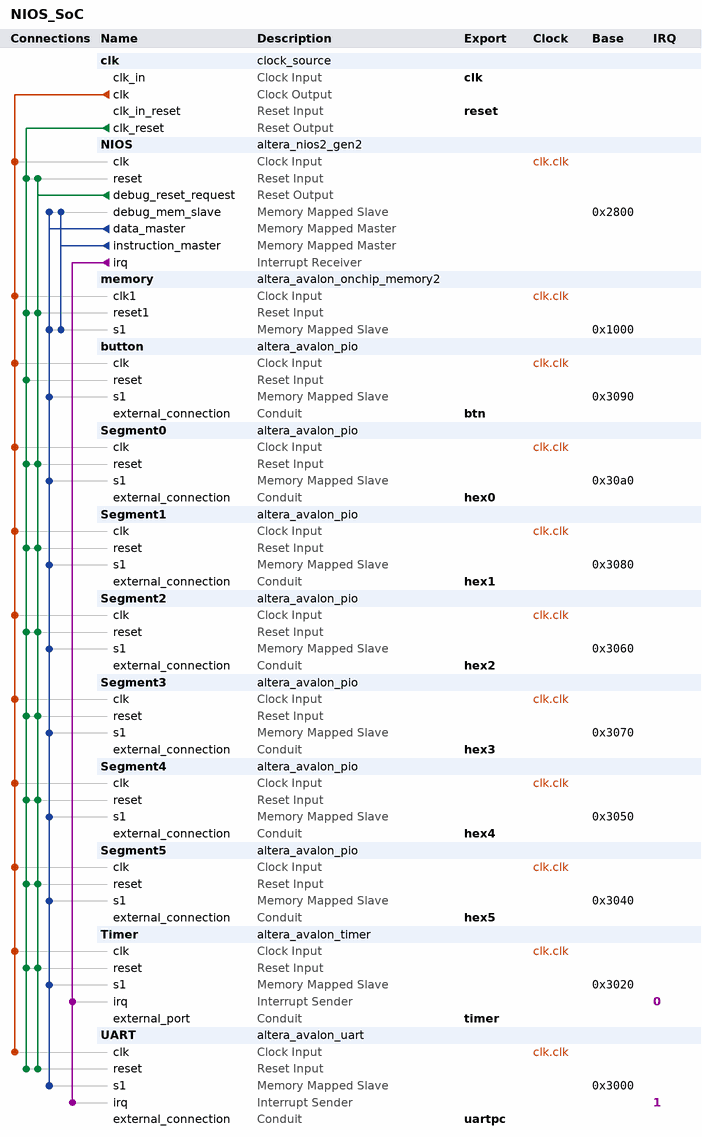
[diagram p0: system contents]
# Platform Designer (Qsys) system NIOS_SoC, Cyclone V 5CSEMA5F31C6
# Parameters at their usual value, and those the tool derives, are not listed.
package require -exact qsys 18.1
create_system NIOS_SoC
set_project_property DEVICE_FAMILY {Cyclone V}
set_project_property DEVICE 5CSEMA5F31C6

add_instance clk clock_source 18.1
set_instance_parameter_value clk clockFrequency 50000000

add_instance NIOS altera_nios2_gen2 18.1
set_instance_parameter_value NIOS dcache_size 2048
set_instance_parameter_value NIOS exceptionSlave memory.s1
set_instance_parameter_value NIOS icache_size 4096
set_instance_parameter_value NIOS impl Tiny
set_instance_parameter_value NIOS resetSlave memory.s1

add_instance memory altera_avalon_onchip_memory2 18.1
set_instance_parameter_value memory dataWidth 32
set_instance_parameter_value memory dualPort false
set_instance_parameter_value memory initMemContent true
set_instance_parameter_value memory initializationFileName onchip_mem.hex
set_instance_parameter_value memory memorySize 4096

add_instance button altera_avalon_pio 18.1
set_instance_parameter_value button direction Input
set_instance_parameter_value button width 4

add_instance Segment0 altera_avalon_pio 18.1
set_instance_parameter_value Segment0 direction Output
set_instance_parameter_value Segment0 width 7

add_instance Segment1 altera_avalon_pio 18.1
set_instance_parameter_value Segment1 direction Output
set_instance_parameter_value Segment1 width 7

add_instance Segment2 altera_avalon_pio 18.1
set_instance_parameter_value Segment2 direction Output
set_instance_parameter_value Segment2 width 7

add_instance Segment3 altera_avalon_pio 18.1
set_instance_parameter_value Segment3 direction Output
set_instance_parameter_value Segment3 width 7

add_instance Segment4 altera_avalon_pio 18.1
set_instance_parameter_value Segment4 direction Output
set_instance_parameter_value Segment4 width 7

add_instance Segment5 altera_avalon_pio 18.1
set_instance_parameter_value Segment5 direction Output
set_instance_parameter_value Segment5 width 7

add_instance Timer altera_avalon_timer 18.1
set_instance_parameter_value Timer alwaysRun true
set_instance_parameter_value Timer period 1
set_instance_parameter_value Timer periodUnits SEC
set_instance_parameter_value Timer timeoutPulseOutput true

add_instance UART altera_avalon_uart 18.1
set_instance_parameter_value UART baud 115200
set_instance_parameter_value UART dataBits 8
set_instance_parameter_value UART fixedBaud true
set_instance_parameter_value UART parity NONE
set_instance_parameter_value UART stopBits 1

# connections
add_connection clk.clk button.clk clock
add_connection clk.clk memory.clk1 clock
add_connection clk.clk NIOS.clk clock
add_connection clk.clk Segment0.clk clock
add_connection clk.clk Segment1.clk clock
add_connection clk.clk Segment2.clk clock
add_connection clk.clk Segment3.clk clock
add_connection clk.clk Segment4.clk clock
add_connection clk.clk Segment5.clk clock
add_connection clk.clk Timer.clk clock
add_connection clk.clk UART.clk clock
add_connection clk.clk_reset button.reset reset
add_connection clk.clk_reset memory.reset1 reset
add_connection clk.clk_reset NIOS.reset reset
add_connection clk.clk_reset Segment0.reset reset
add_connection clk.clk_reset Segment1.reset reset
add_connection clk.clk_reset Segment2.reset reset
add_connection clk.clk_reset Segment3.reset reset
add_connection clk.clk_reset Segment4.reset reset
add_connection clk.clk_reset Segment5.reset reset
add_connection clk.clk_reset Timer.reset reset
add_connection clk.clk_reset UART.reset reset
add_connection NIOS.debug_reset_request memory.reset1 reset
add_connection NIOS.debug_reset_request NIOS.reset reset
add_connection NIOS.debug_reset_request Segment0.reset reset
add_connection NIOS.debug_reset_request Segment1.reset reset
add_connection NIOS.debug_reset_request Segment2.reset reset
add_connection NIOS.debug_reset_request Segment3.reset reset
add_connection NIOS.debug_reset_request Segment4.reset reset
add_connection NIOS.debug_reset_request Segment5.reset reset
add_connection NIOS.debug_reset_request Timer.reset reset
add_connection NIOS.debug_reset_request UART.reset reset
add_connection NIOS.data_master button.s1 avalon
set_connection_parameter_value NIOS.data_master/button.s1 baseAddress 0x3090
add_connection NIOS.data_master memory.s1 avalon
set_connection_parameter_value NIOS.data_master/memory.s1 baseAddress 0x1000
add_connection NIOS.data_master NIOS.debug_mem_slave avalon
set_connection_parameter_value NIOS.data_master/NIOS.debug_mem_slave baseAddress 0x2800
add_connection NIOS.data_master Segment0.s1 avalon
set_connection_parameter_value NIOS.data_master/Segment0.s1 baseAddress 0x30a0
add_connection NIOS.data_master Segment1.s1 avalon
set_connection_parameter_value NIOS.data_master/Segment1.s1 baseAddress 0x3080
add_connection NIOS.data_master Segment2.s1 avalon
set_connection_parameter_value NIOS.data_master/Segment2.s1 baseAddress 0x3060
add_connection NIOS.data_master Segment3.s1 avalon
set_connection_parameter_value NIOS.data_master/Segment3.s1 baseAddress 0x3070
add_connection NIOS.data_master Segment4.s1 avalon
set_connection_parameter_value NIOS.data_master/Segment4.s1 baseAddress 0x3050
add_connection NIOS.data_master Segment5.s1 avalon
set_connection_parameter_value NIOS.data_master/Segment5.s1 baseAddress 0x3040
add_connection NIOS.data_master Timer.s1 avalon
set_connection_parameter_value NIOS.data_master/Timer.s1 baseAddress 0x3020
add_connection NIOS.data_master UART.s1 avalon
set_connection_parameter_value NIOS.data_master/UART.s1 baseAddress 0x3000
add_connection NIOS.instruction_master memory.s1 avalon
set_connection_parameter_value NIOS.instruction_master/memory.s1 baseAddress 0x1000
add_connection NIOS.instruction_master NIOS.debug_mem_slave avalon
set_connection_parameter_value NIOS.instruction_master/NIOS.debug_mem_slave baseAddress 0x2800
add_connection NIOS.irq Timer.irq interrupt
set_connection_parameter_value NIOS.irq/Timer.irq irqNumber 0
add_connection NIOS.irq UART.irq interrupt
set_connection_parameter_value NIOS.irq/UART.irq irqNumber 1

# exported interfaces
add_interface btn conduit end
set_interface_property btn EXPORT_OF button.external_connection
add_interface clk clock sink
set_interface_property clk EXPORT_OF clk.clk_in
add_interface hex0 conduit end
set_interface_property hex0 EXPORT_OF Segment0.external_connection
add_interface hex1 conduit end
set_interface_property hex1 EXPORT_OF Segment1.external_connection
add_interface hex2 conduit end
set_interface_property hex2 EXPORT_OF Segment2.external_connection
add_interface hex3 conduit end
set_interface_property hex3 EXPORT_OF Segment3.external_connection
add_interface hex4 conduit end
set_interface_property hex4 EXPORT_OF Segment4.external_connection
add_interface hex5 conduit end
set_interface_property hex5 EXPORT_OF Segment5.external_connection
add_interface reset reset sink
set_interface_property reset EXPORT_OF clk.clk_in_reset
add_interface timer conduit end
set_interface_property timer EXPORT_OF Timer.external_port
add_interface uartpc conduit end
set_interface_property uartpc EXPORT_OF UART.external_connection

set_interconnect_requirement {$system} qsys_mm.clockCrossingAdapter HANDSHAKE
set_interconnect_requirement {$system} qsys_mm.enableEccProtection FALSE
set_interconnect_requirement {$system} qsys_mm.insertDefaultSlave FALSE
set_interconnect_requirement {$system} qsys_mm.maxAdditionalLatency 1

save_system NIOS_SoC.qsys
